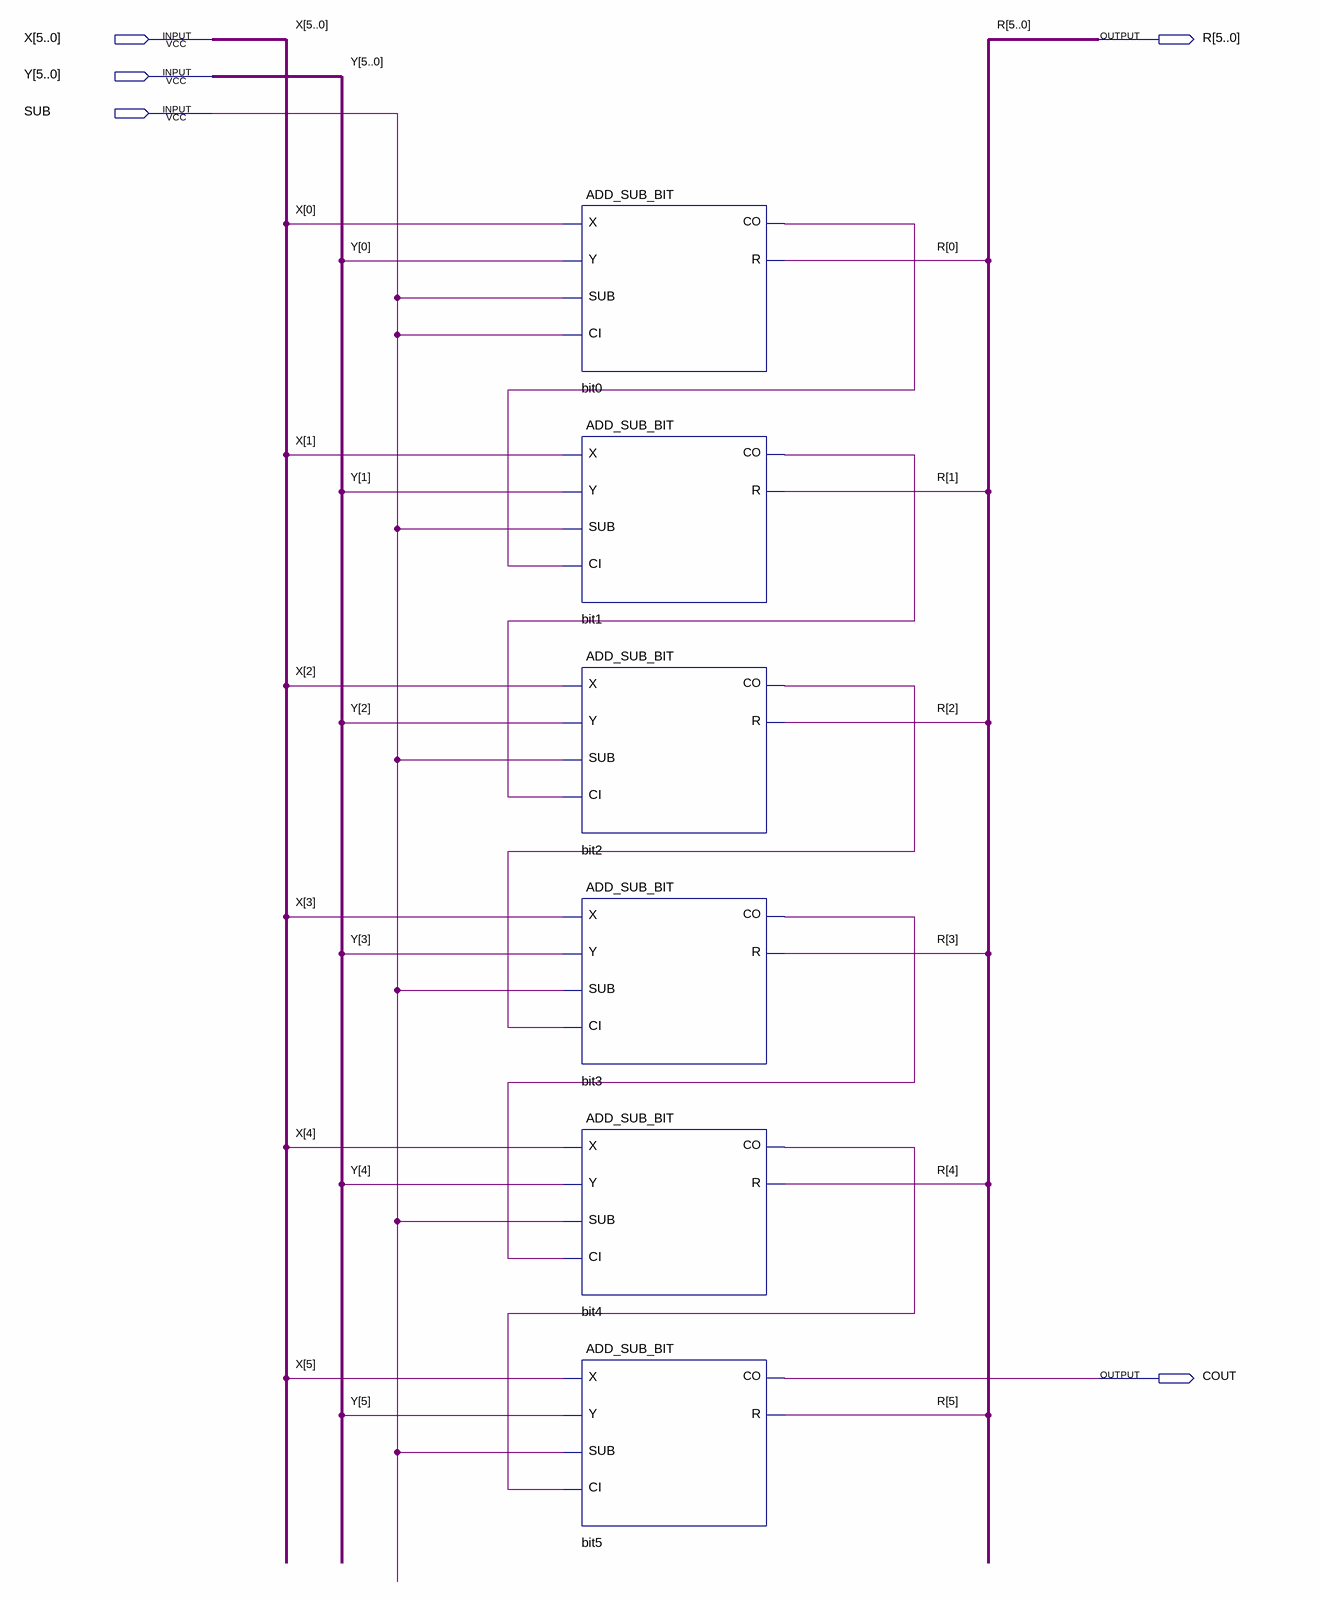
[diagram p0: schematic sheet]
// Quartus schematic ADD_SUB6.bdf as structural Verilog: 6 symbols, 5 pins
module ADD_SUB6 (
  input  [5:0] X,
  input  [5:0] Y,
  input  SUB,
  output [5:0] R,
  output COUT
);

  wire bit0_co, bit1_co, bit2_co, bit3_co, bit4_co;

  ADD_SUB_BIT bit0 (.X(X[0]), .Y(Y[0]), .SUB(SUB), .CI(SUB), .CO(bit0_co), .R(R[0]));
  ADD_SUB_BIT bit1 (.X(X[1]), .Y(Y[1]), .SUB(SUB), .CI(bit0_co), .CO(bit1_co), .R(R[1]));
  ADD_SUB_BIT bit2 (.X(X[2]), .Y(Y[2]), .SUB(SUB), .CI(bit1_co), .CO(bit2_co), .R(R[2]));
  ADD_SUB_BIT bit3 (.X(X[3]), .Y(Y[3]), .SUB(SUB), .CI(bit2_co), .CO(bit3_co), .R(R[3]));
  ADD_SUB_BIT bit4 (.X(X[4]), .Y(Y[4]), .SUB(SUB), .CI(bit3_co), .CO(bit4_co), .R(R[4]));
  ADD_SUB_BIT bit5 (.X(X[5]), .Y(Y[5]), .SUB(SUB), .CI(bit4_co), .CO(COUT), .R(R[5]));
endmodule
